# Altium schematic sheet Parallel To Serial Converter.SchDoc
size A; Organization: Altium Limited; Address1: L3, 12a Rodborough Rd; Address2: Frenchs Forest; Address3: NSW; Address4: Australia 2086; DocumentNumber: 1; SheetNumber: 1; SheetTotal: 1
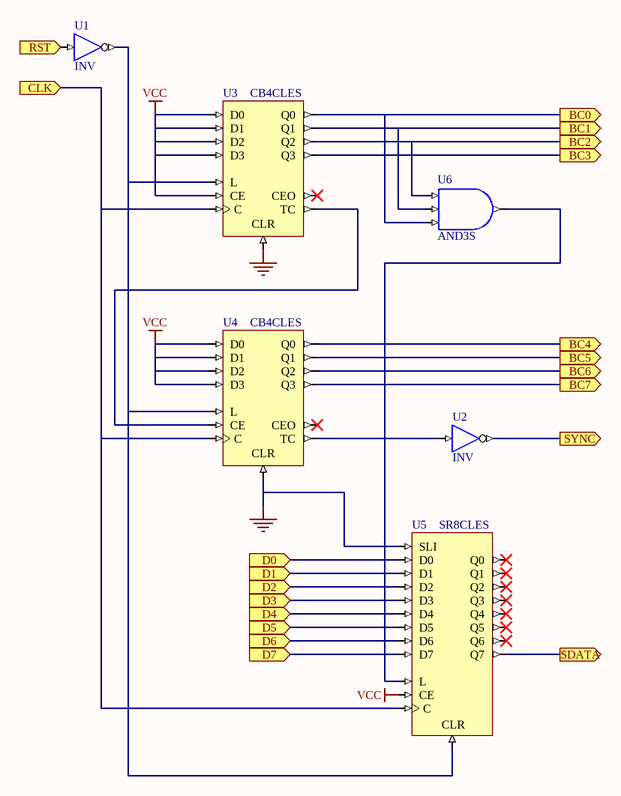
[diagram p0: Parallel To Serial Converter.SchDoc]

## Parts
U1  INV
U2  INV
U3  CB4CLES
U4  CB4CLES
U5  SR8CLES
U6  AND3S

## Ports
BC0 (out), BC1 (out), BC2 (out), BC3 (out), BC4 (out), BC5 (out), BC6 (out), BC7 (out), CLK (in), D0 (in), D1 (in), D2 (in), D3 (in), D4 (in), D5 (in), D6 (in), D7 (in), RST (in), SDATA (out), SYNC (out)

## Nets
GND: U3.CLR U4.CLR U5.SLI
VCC: U3.CE U3.D0 U3.D1 U3.D2 U3.D3 U4.D0 U4.D1 U4.D2 U4.D3 U5.CE
BC0: U3.Q0 U6.I2 ; port BC0
BC1: U3.Q1 U6.I1 ; port BC1
BC2: U3.Q2 U6.I0 ; port BC2
BC3: U3.Q3 ; port BC3
BC4: U4.Q0 ; port BC4
BC5: U4.Q1 ; port BC5
BC6: U4.Q2 ; port BC6
BC7: U4.Q3 ; port BC7
CLK: U3.C U4.C U5.C ; port CLK
D0: U5.D0 ; port D0
D1: U5.D1 ; port D1
D2: U5.D2 ; port D2
D3: U5.D3 ; port D3
D4: U5.D4 ; port D4
D5: U5.D5 ; port D5
D6: U5.D6 ; port D6
D7: U5.D7 ; port D7
RST: U1.I ; port RST
SDATA: U5.Q7 ; port SDATA
SYNC: U2.O ; port SYNC
NetU1_O: U1.O U3.L U4.L U5.CLR
NetU2_I: U2.I U4.TC
NetU3_TC: U3.TC U4.CE
NetU5_L: U5.L U6.O

Not connected (* = marked no-connect by the designer): U3 CEO*; U4 CEO*; U5 Q0* Q1* Q2* Q3* Q4* Q5* Q6*

## Notes on the sheet
- Title
- Size:
- Date:
- A
- Number:
- Time:
- Revision:
- Sheet
- of
- File:

## Library data of the parts
U1 U2 = INV: Inverter; ArchiveName: GENERIC; VHDLIB_SIM: GENERIC_LIB; Published: 28-Jan-2004; Publisher: Altium Limited; Xilinx Equivalent: INV; Core Revision: 1.00.00
U3 U4 = CB4CLES: 4-Bit Loadable Cascadable Binary Counter with Clock Enable and Asynchronous Clear, Single Pin Version; Xilinx Equivalent: CB4CLE; ArchiveName: GENERIC; VHDLIB_SIM: GENERIC_LIB; Published: 28-Jan-2004; Publisher: Altium Limited; Core Revision: 1.00.00
U5 = SR8CLES: 8-Bit Loadable Serial/Parallel-In Parallel-Out Shift Registers with Clock Enable and Asynchronous Clear, Single Pin Version; ArchiveName: GENERIC; VHDLIB_SIM: GENERIC_LIB; Published: 28-Jan-2004; Publisher: Altium Limited; Core Revision: 1.00.00
U6 = AND3S: 3-Input AND Gate, Single Pin Version; Xilinx Equivalent: AND3; ArchiveName: GENERIC; VHDLIB_SIM: GENERIC_LIB; Published: 28-Jan-2004; Publisher: Altium Limited; Core Revision: 1.00.00